# Altium project LCD&KeyV2.PrjPcb
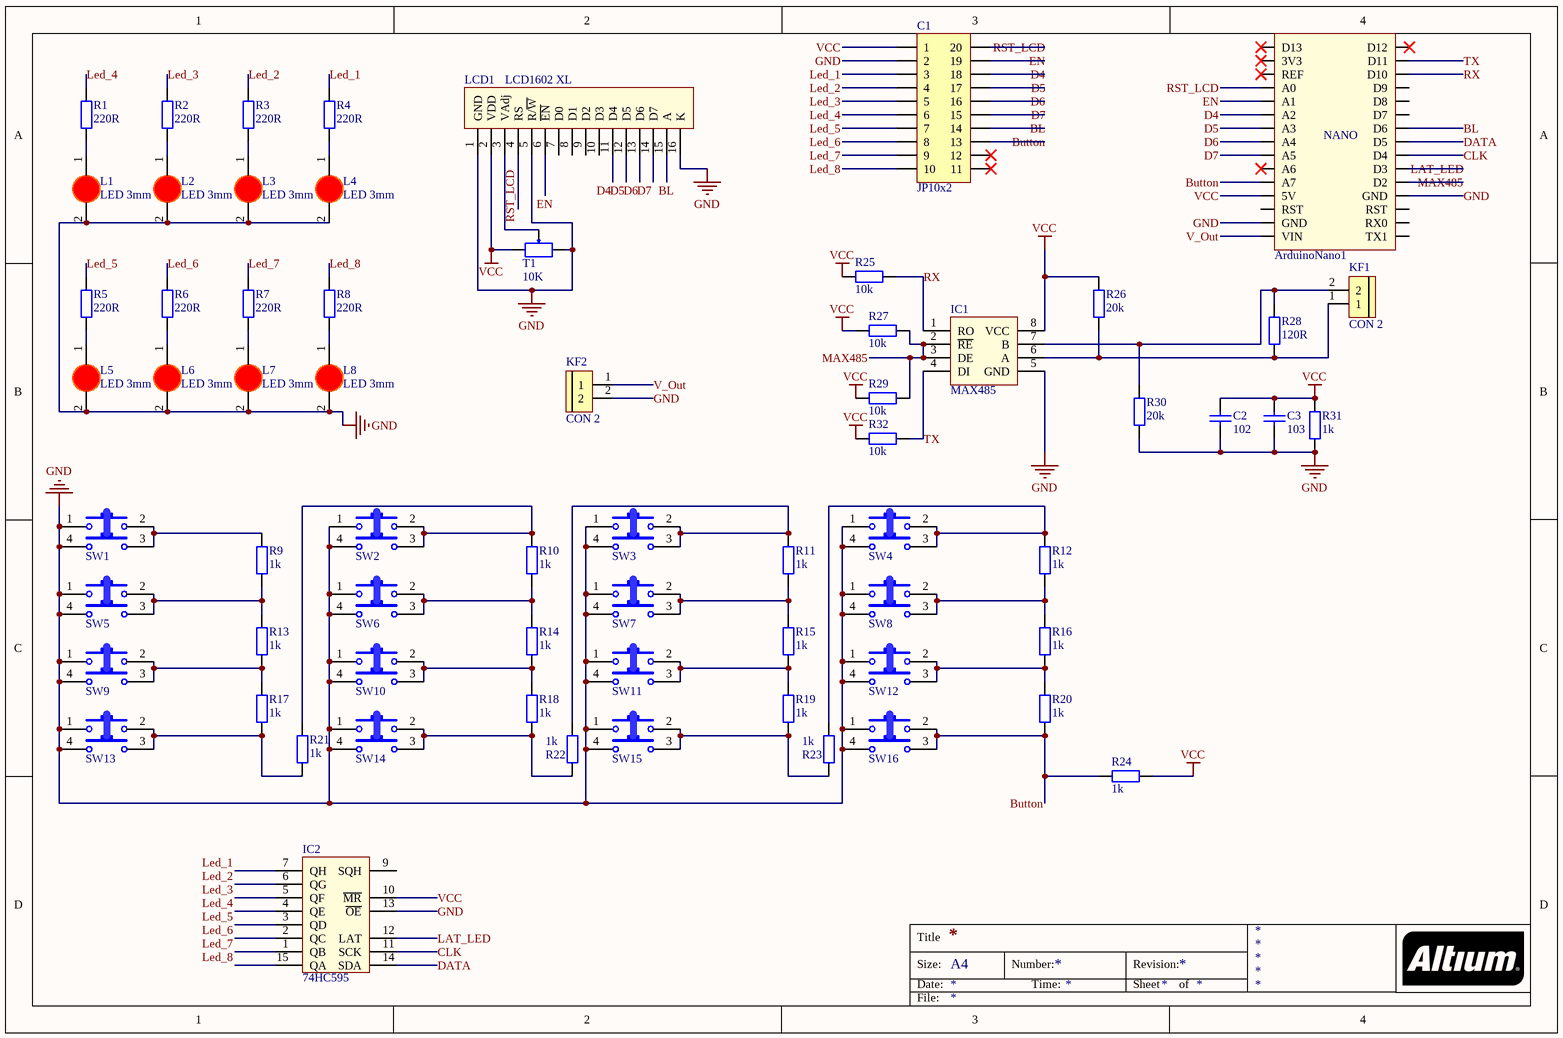
[diagram p0: Sheet3.SchDoc]
1 sheet, 66 parts. Net scope: global (net labels, ports and power ports of the same name join across sheets).
Board file: PCB3.PcbDoc

## Sheet Sheet3.SchDoc
size A4

### Parts
ArduinoNano1  Arduino Nano  [Arduino Nano]  (value not drawn)
C1  JP10x2  [JP10-C2T]
C2  102  [tu gom]
C3  103  [tu gom]
IC1  MAX485  [DIP8/W0.3]
IC2  74HC595  [DIP16/W0.3]
KF1  CON 2  [Con 2 KF301 5.08]
KF2  CON 2  [Con 2 KF301 5.08]
L1  LED 3mm  [LED-3MM-RED]
L2  LED 3mm  [LED-3MM-RED]
L3  LED 3mm  [LED-3MM-RED]
L4  LED 3mm  [LED-3MM-RED]
L5  LED 3mm  [LED-3MM-RED]
L6  LED 3mm  [LED-3MM-RED]
L7  LED 3mm  [LED-3MM-RED]
L8  LED 3mm  [LED-3MM-RED]
LCD1  LCD1602 XL  [LCD1602 with Jump]
R1  220R  [tro vach 1/4w]
R2  220R  [tro vach 1/4w]
R3  220R  [tro vach 1/4w]
R4  220R  [tro vach 1/4w]
R5  220R  [tro vach 1/4w]
R6  220R  [tro vach 1/4w]
R7  220R  [tro vach 1/4w]
R8  220R  [tro vach 1/4w]
R9  1k  [tro vach 1/2w]
R10  1k  [tro vach 1/2w]
R11  1k  [tro vach 1/2w]
R12  1k  [tro vach 1/2w]
R13  1k  [tro vach 1/2w]
R14  1k  [tro vach 1/2w]
R15  1k  [tro vach 1/2w]
R16  1k  [tro vach 1/2w]
R17  1k  [tro vach 1/2w]
R18  1k  [tro vach 1/2w]
R19  1k  [tro vach 1/2w]
R20  1k  [tro vach 1/2w]
R21  1k  [tro vach 1/2w]
R22  1k  [tro vach 1/2w]
R23  1k  [tro vach 1/2w]
R24  1k  [tro vach 1/2w]
R25  10k  [tro vach 1/4w]
R26  20k  [tro vach 1/4w]
R27  10k  [tro vach 1/4w]
R28  120R  [tro vach 1/4w]
R29  10k  [tro vach 1/4w]
R30  20k  [tro vach 1/4w]
R31  1k  [tro vach 1/4w]
R32  10k  [tro vach 1/4w]
SW1  SW-4P-B  [SW-4P-B]  (value not drawn)
SW2  SW-4P-B  [SW-4P-B]  (value not drawn)
SW3  SW-4P-B  [SW-4P-B]  (value not drawn)
SW4  SW-4P-B  [SW-4P-B]  (value not drawn)
SW5  SW-4P-B  [SW-4P-B]  (value not drawn)
SW6  SW-4P-B  [SW-4P-B]  (value not drawn)
SW7  SW-4P-B  [SW-4P-B]  (value not drawn)
SW8  SW-4P-B  [SW-4P-B]  (value not drawn)
SW9  SW-4P-B  [SW-4P-B]  (value not drawn)
SW10  SW-4P-B  [SW-4P-B]  (value not drawn)
SW11  SW-4P-B  [SW-4P-B]  (value not drawn)
SW12  SW-4P-B  [SW-4P-B]  (value not drawn)
SW13  SW-4P-B  [SW-4P-B]  (value not drawn)
SW14  SW-4P-B  [SW-4P-B]  (value not drawn)
SW15  SW-4P-B  [SW-4P-B]  (value not drawn)
SW16  SW-4P-B  [SW-4P-B]  (value not drawn)
T1  10K  [Bien Tro Vi Chinh Dung]

### Nets
GND: ArduinoNano1.GND C1.2 C2.2 C3.2 IC1.5(GND) IC2.8(GND) IC2.13(~{OE}) KF2.2 L1.2(K) L2.2(K) L3.2(K) L4.2(K) L5.2(K) L6.2(K) L7.2(K) L8.2(K) LCD1.1(GND) LCD1.5(R/~{W}) LCD1.16(K) R30.1 R31.1 SW1.1 SW1.4 SW2.1 SW2.4 SW3.1 SW3.4 SW4.1 SW4.4 SW5.1 SW5.4 SW6.1 SW6.4 SW7.1 SW7.4 SW8.1 SW8.4 SW9.1 SW9.4 SW10.1 SW10.4 SW11.1 SW11.4 SW12.1 SW12.4 SW13.1 SW13.4 SW14.1 SW14.4 SW15.1 SW15.4 SW16.1 SW16.4 T1.3
VCC: ArduinoNano1.5V C1.1 C2.1 C3.1 IC1.8(VCC) IC2.10(~{MR}) IC2.16(VCC) LCD1.2(VDD) R24.1 R25.1 R26.2 R27.1 R29.1 R31.2 R32.1 T1.1
BL: ArduinoNano1.D6 C1.14 LCD1.15(A)
Button: ArduinoNano1.A7 C1.13 R20.1 R24.2 SW16.2 SW16.3
CLK: ArduinoNano1.D4 IC2.11(SCK)
D4: ArduinoNano1.A2 C1.18 LCD1.11(D4)
D5: ArduinoNano1.A3 C1.17 LCD1.12(D5)
D6: ArduinoNano1.A4 C1.16 LCD1.13(D6)
D7: ArduinoNano1.A5 C1.15 LCD1.14(D7)
DATA: ArduinoNano1.D5 IC2.14(SDA)
EN: ArduinoNano1.A1 C1.19 LCD1.6(~{EN})
LAT_LED: ArduinoNano1.D3 IC2.12(LAT)
Led_1: C1.3 IC2.7(QH) R4.2
Led_2: C1.4 IC2.6(QG) R3.2
Led_3: C1.5 IC2.5(QF) R2.2
Led_4: C1.6 IC2.4(QE) R1.2
Led_5: C1.7 IC2.3(QD) R5.2
Led_6: C1.8 IC2.2(QC) R6.2
Led_7: C1.9 IC2.1(QB) R7.2
Led_8: C1.10 IC2.15(QA) R8.2
MAX485: ArduinoNano1.D2 IC1.2(~{RE}) IC1.3(DE) R27.2 R29.2
RST_LCD: ArduinoNano1.A0 C1.20 LCD1.4(RS)
RX: ArduinoNano1.D10 IC1.1(RO) R25.2
TX: ArduinoNano1.D11 IC1.4(DI) R32.2
V_Out: ArduinoNano1.VIN KF2.1
NetIC1_6: IC1.6(A) KF1.1 R26.1 R28.1
NetIC1_7: IC1.7(B) KF1.2 R28.2 R30.2
NetL1_1: L1.1(A) R1.1
NetL2_1: L2.1(A) R2.1
NetL3_1: L3.1(A) R3.1
NetL4_1: L4.1(A) R4.1
NetL5_1: L5.1(A) R5.1
NetL6_1: L6.1(A) R6.1
NetL7_1: L7.1(A) R7.1
NetL8_1: L8.1(A) R8.1
NetLCD1_3: LCD1.3(VAdj) T1.2
NetR9_1: R9.1 R13.2 SW5.2 SW5.3
NetR9_2: R9.2 SW1.2 SW1.3
NetR10_1: R10.1 R14.2 SW6.2 SW6.3
NetR10_2: R10.2 R21.2 SW2.2 SW2.3
NetR11_1: R11.1 R15.2 SW7.2 SW7.3
NetR11_2: R11.2 R22.2 SW3.2 SW3.3
NetR12_1: R12.1 R16.2 SW8.2 SW8.3
NetR12_2: R12.2 R23.2 SW4.2 SW4.3
NetR13_1: R13.1 R17.2 SW9.2 SW9.3
NetR14_1: R14.1 R18.2 SW10.2 SW10.3
NetR15_1: R15.1 R19.2 SW11.2 SW11.3
NetR16_1: R16.1 R20.2 SW12.2 SW12.3
NetR17_1: R17.1 R21.1 SW13.2 SW13.3
NetR18_1: R18.1 R22.1 SW14.2 SW14.3
NetR19_1: R19.1 R23.1 SW15.2 SW15.3

Not connected (* = marked no-connect by the designer): ArduinoNano1 3V3* A6* D7 D8 D9 D12* D13* REF* RST RX0 TX1; C1 11* 12*; IC2 9(SQH); LCD1 7(D0) 8(D1) 9(D2) 10(D3)

### Notes on the sheet
- Title
- Size:
- Date:
- A4
- Number:
- Time:
- Revision:
- Sheet
- of
- File:
- (in symbol Arduino Nano) NANO

### Library data of the parts
ArduinoNano1 = Arduino Nano: Value: Cau 1A
C1 = JP10x2: WR-PHD 2.54 mm Dual Socket Header; Manufacturer: W¨¹rth Elektronik eiSos GmbH; partNo: 61302021821; ComponentLink1 Description: Manufacturer; ComponentLink2 Description: Datasheet; NoPins: 20; Created Date: 29 March 2013; ComponentLink1URL: http://www.we-online.com; ComponentLink2URL: http://katalog.we-online.de/em/datasheet/6130xx21821.pdf; Created by: Karrer Zheng
C2 = Tu gom 102 50V: Cắm; Don_Vi: Con; So_Chan: 2; Ten_Linh_Kien: Tụ gốm 102 1nF 50V; Ma_Hang: MH004763; Chung_Loai: Cắm; Kieu_Chan: *
C3 = Tu gom 103 50V: Cắm; So_Chan: 2; Ten_Linh_Kien: Tụ gốm 103 10nF 50V; Don_Vi: Con; Ma_Hang: MH000936; Chung_Loai: Cắm; Kieu_Chan: *
IC1 = MAX485: RS232 - RS485 (Same sn75176)
IC2 = 74595: 8 Bit Serial input - Parallel Output; Value: 74HC595
KF1 KF2 = CON 2 KF301: Cắm; Ma_Hang: MH000987; Ten_Linh_Kien: CON 2 KF301-2P 5.08MM Xanh Dương; Chung_Loai: Cắm; Ghi_Chu: *; Kieu_Chan: *; Don_Vi: Con
L1-L8 = LED 3mm Do: Cắm; Don_Vi: Con; Ma_Hang: MH003892; Ten_Linh_Kien: Led 3MM Phủ Đỏ (10c); Ghi_Chu: *; Kieu_Chan: *; Chung_Loai: Cắm
LCD1 = LCD1602 XL: LCD 1602 Xanh Lá; Ten: Màn hình LCD 1602 Xanh Lá; Ma_Hang: 67HZ; NCC: NSHOP; CHIP: HD44780
R1-R8 = Tro Vach 1/4W 5% 220R: Cắm; Don_Vi: Con; So_Chan: 2; Ten_Linh_Kien: Trở Vạch 1/4w 5% 220R; Ma_Hang: MH007300; Chung_Loai: Cắm; Kieu_Chan: *
R9-R24 = Tro Vach 1/2W 5% 1k: Cắm; Don_Vi: Con; So_Chan: 2; Ten_Linh_Kien: Trở 5% 1/2w 1K; Ma_Hang: MH007240; Chung_Loai: Cắm; Kieu_Chan: *
R25 R27 R29 R32 = Tro Vach 1/4W 1% 10k: Cắm; Don_Vi: Con; So_Chan: 2; Ten_Linh_Kien: Trở Vạch 1/4w 1% 10k; Ma_Hang: MH006349; Chung_Loai: Cắm; Kieu_Chan: *
R26 R30 = Tro Vach 1/4W 5% 20k: Cắm; Don_Vi: Con; So_Chan: 2; Ten_Linh_Kien: Trở Vạch 1/4w 5% 20k; Ma_Hang: MH007297; Chung_Loai: Cắm; Kieu_Chan: *
R28 = Tro Vach 1/4W 5% 120R: Cắm; Don_Vi: Con; So_Chan: 2; Ten_Linh_Kien: Trở Vạch 1/4W 5% 120R; Ma_Hang: MH007388; Chung_Loai: Cắm; Kieu_Chan: *
R31 = Tro Vach 1/4W 5% 1k: Cắm; Don_Vi: Con; So_Chan: 2; Ten_Linh_Kien: Trở Vạch 1/4w 5% 1k; Ma_Hang: MH007390; Chung_Loai: Cắm; Kieu_Chan: *
SW1-SW16 = SW-4PIN-BIG_1: Switch Big 4 Pin; Published: 24-Mar-1999; LatestRevisionDate: 17-Jul-2002; LatestRevisionNote: Re-released for DXP Platform.; PackageReference: SPST-2; Publisher: Altium Limited
T1 = Bien Tro Tinh Chinh 10K Dung: Cắm; Ma_Hang: MH003232; Ten_Linh_Kien: Biến Trở VR 103-10K 3296W; Don_Vi: Con; Kieu_Chan: *; Chung_Loai: Cắm; Ghi_Chu: *